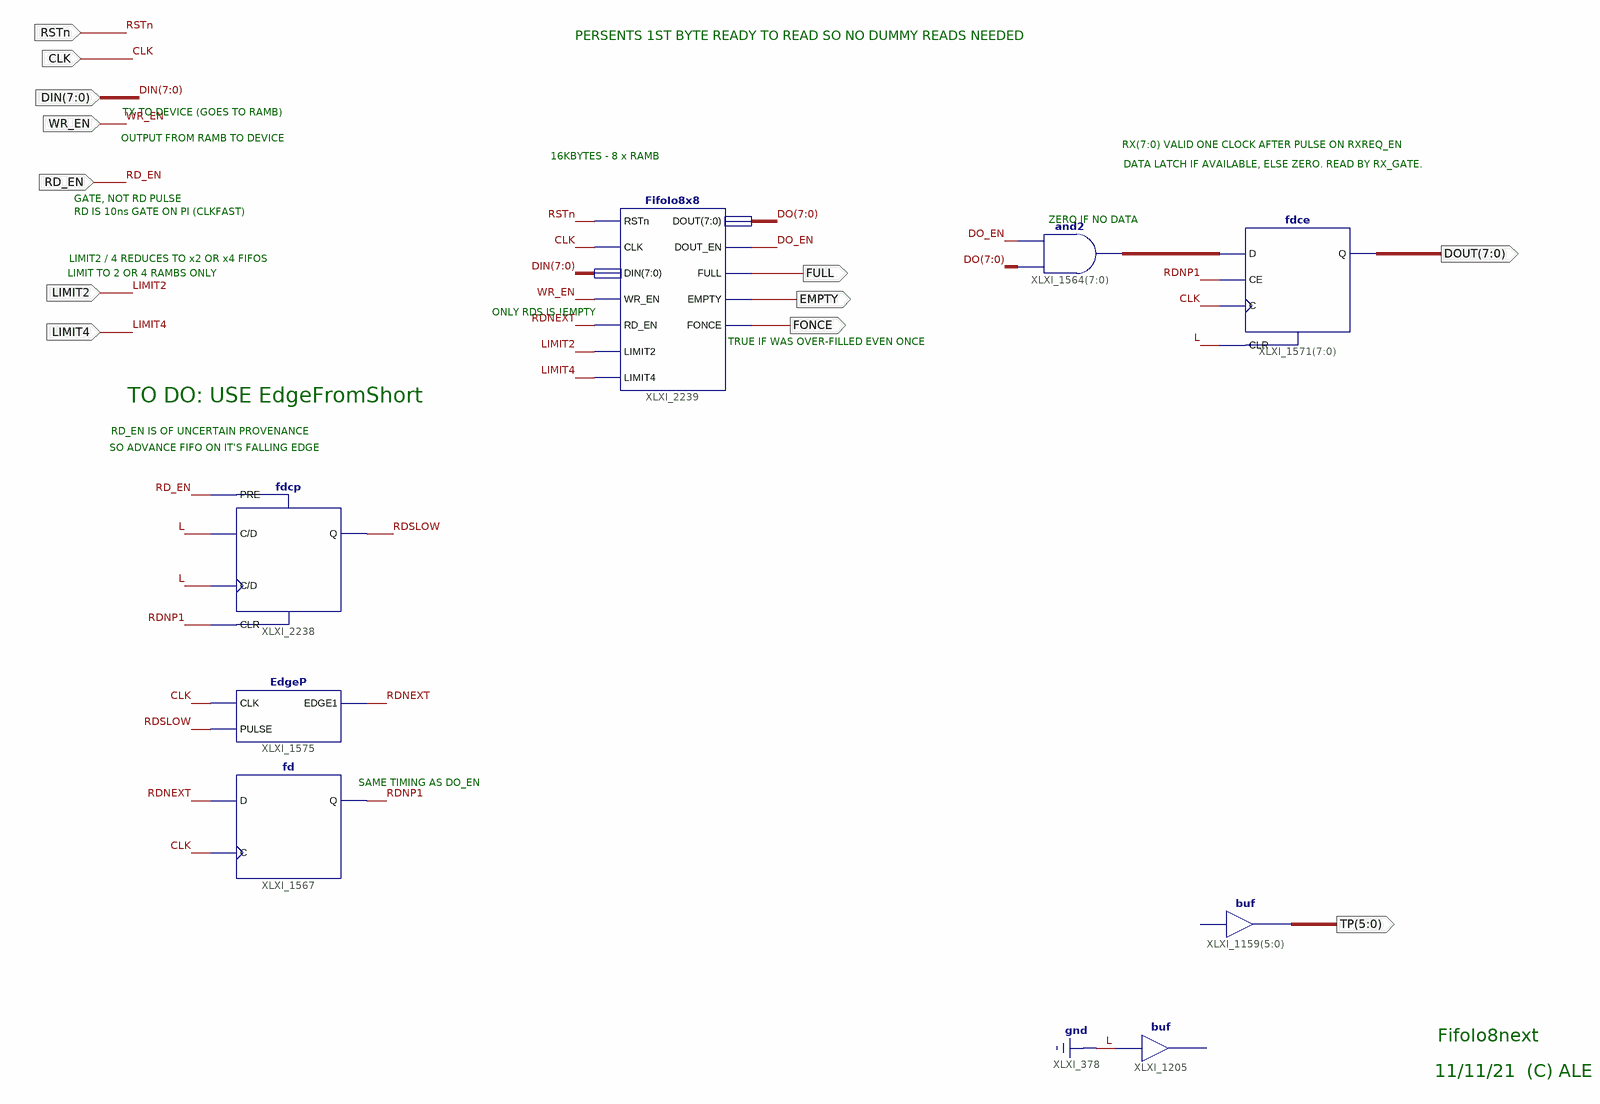
[diagram p0: schematic sheet 1]
// Xilinx ISE schematic FifoIo8next.sch (spartan3e) as structural Verilog: 8 symbols, 12 ports
module FifoIo8next (
  input  CLK,
  input  RSTn,
  input  [7:0] DIN,
  input  WR_EN,
  input  RD_EN,
  input  LIMIT2,
  input  LIMIT4,
  output [5:0] TP,
  output [7:0] DOUT,
  output FULL,
  output FONCE,
  output EMPTY
);

  wire DO_EN, RDNEXT, RDNP1, RDSLOW;
  wire [7:0] DO, XLXN_54;

  // buf XLXI_1159[5..0] has open pins: I=open, O=TP
  // buf XLXI_1205 has open pins: I=1'b0, O=open
  assign XLXN_54 = DO & {8{DO_EN}};  // and2 XLXI_1564[7..0], 8 bits wide
  fdce XLXI_1571[7:0] (.C(CLK), .CE(RDNP1), .CLR(1'b0), .D(XLXN_54), .Q(DOUT));
  fd XLXI_1567 (.C(CLK), .D(RDNEXT), .Q(RDNP1));
  EdgeP XLXI_1575 (.CLK(CLK), .EDGE1(RDNEXT), .PULSE(RDSLOW));
  fdcp XLXI_2238 (.C(1'b0), .CLR(RDNP1), .D(1'b0), .PRE(RD_EN), .Q(RDSLOW));
  FifoIo8x8 XLXI_2239 (
    .CLK(CLK), .DIN(DIN), .DOUT(DO), .DOUT_EN(DO_EN), .EMPTY(EMPTY), .FONCE(FONCE), .FULL(FULL),
    .LIMIT2(LIMIT2), .LIMIT4(LIMIT4), .RD_EN(RDNEXT), .RSTn(RSTn), .WR_EN(WR_EN));

  // Notes on the sheet:
  //   PERSENTS 1ST BYTE READY TO READ SO NO DUMMY READS NEEDED
  //   TX TO DEVICE (GOES TO RAMB)
  //   OUTPUT FROM RAMB TO DEVICE
  //   RX(7:0) VALID ONE CLOCK AFTER PULSE ON RXREQ_EN
  //   16KBYTES - 8 x RAMB
  //   DATA LATCH IF AVAILABLE, ELSE ZERO. READ BY RX_GATE.
  //   GATE, NOT RD PULSE
  //   RD IS 10ns GATE ON PI (CLKFAST)
  //   ZERO IF NO DATA
  //   LIMIT2 / 4 REDUCES TO x2 OR x4 FIFOS
  //   LIMIT TO 2 OR 4 RAMBS ONLY
  //   ONLY RDS IS !EMPTY
  //   TRUE IF WAS OVER-FILLED EVEN ONCE
  //   TO DO: USE EdgeFromShort
  //   RD_EN IS OF UNCERTAIN PROVENANCE
  //   SO ADVANCE FIFO ON IT'S FALLING EDGE
  //   SAME TIMING AS DO_EN
  //   FifoIo8next
  //   11/11/21  (C) ALE
endmodule
